# Altium schematic sheet WemosESP8266.SchDoc
size A4
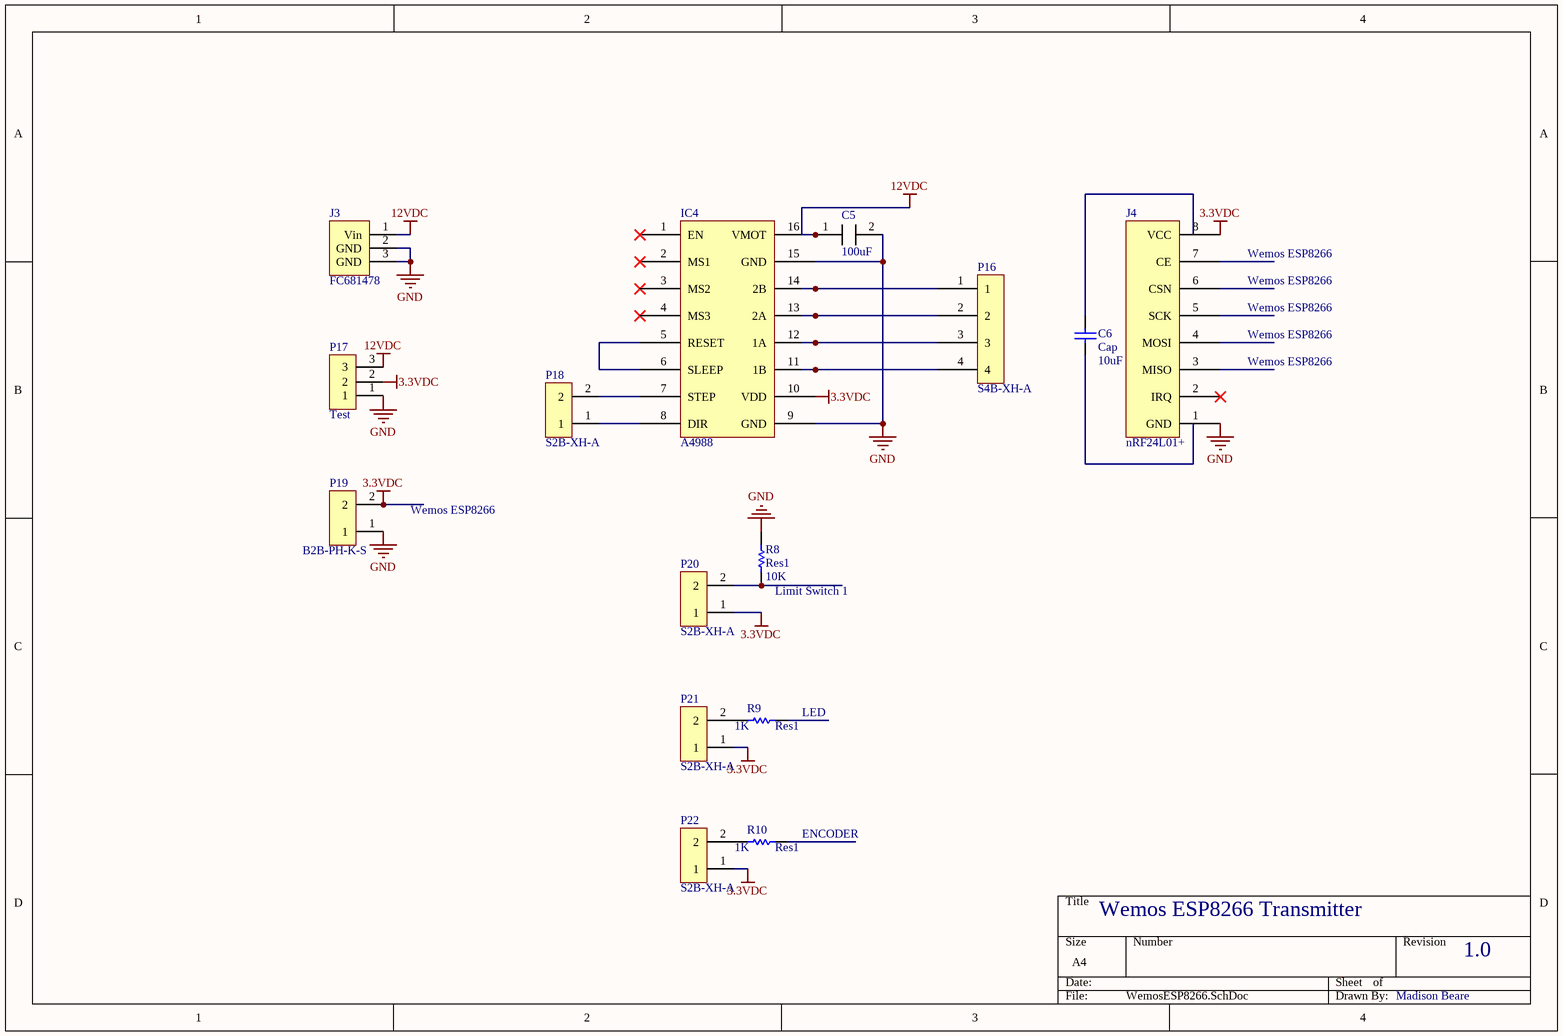
[diagram p0: WemosESP8266.SchDoc]

## Parts
C5  100uF  [EEE-FP1H101AP]
C6  Cap  value 10uF  [RAD-0.3]
IC4  A4988
J3  FC681478
J4  nRF24L01+
P16  S4B-XH-A
P17  Test
P18  S2B-XH-A
P19  B2B-PH-K-S
P20  S2B-XH-A
P21  S2B-XH-A
P22  S2B-XH-A
R8  Res1  value 10K  [AXIAL-0.3]
R9  Res1  value 1K  [AXIAL-0.3]
R10  Res1  value 1K  [AXIAL-0.3]

## Nets
3.3VDC: IC4.10(VDD) J4.8(VCC) P17.2 P19.2 P20.1 P21.1 P22.1
12VDC: C5.1(+-) IC4.16(VMOT) J3.1(Vin) P17.3
GND: C5.2 IC4.9(GND) IC4.15(GND) J3.2(GND) J3.3(GND) J4.1(GND) P19.1 R8.2
NetIC4_5: IC4.5(RESET) IC4.6(SLEEP)
NetIC4_7: IC4.7(STEP) P18.2
NetIC4_8: IC4.8(DIR) P18.1
NetIC4_11: IC4.11(1B) P16.4
NetIC4_12: IC4.12(1A) P16.3
NetIC4_13: IC4.13(2A) P16.2
NetIC4_14: IC4.14(2B) P16.1
NetP20_2: P20.2 R8.1
NetP21_2: P21.2 R9.1
NetP22_2: P22.2 R10.1

Not connected (* = marked no-connect by the designer): C6 1 2; IC4 1(EN)* 2(MS1)* 3(MS2)* 4(MS3)*; J4 2(IRQ)* 3(MISO) 4(MOSI) 5(SCK) 6(CSN) 7(CE); P17 1; R9 2; R10 2

## Notes on the sheet
- Wemos ESP8266
- (near R8) Limit Switch 1
- (near R9) LED
- (near R10) ENCODER
- Wemos ESP8266 Transmitter
- 1.0
- Madison Beare
- Labels drawn without touching a wire or pin: GND

## Library data of the parts
C5 = EEE-FP1H101AP: 100uF capacitor smd 8.3x8.3 dimensions
C6 = Cap: Capacitor; Published: 8-Jun-2000; LatestRevisionDate: 17-Jul-2002; LatestRevisionNote: Re-released for DXP Platform.; PackageReference: RAD-0.3; Publisher: Altium Limited; PackageDescription: Radial Cap, Thru-Hole; 2 Leads; 0.3 in Pin Spacing
J3 = FC681478: CLIFF ELECTRONIC COMPONENTS         FC681478            CONNECTOR, POWER ENTRY, RCPT, 2A, 16VDC; Gender: Male; Voltage Rating: 16V; Supplier 1: Farnell; Manufacturer: Cliff; Manufacturer Part Number: FC681478; RoHS: Yes; Category: Connectors; Stock 1: 534; Pricing 1: 1=1.94000, 50=0.87800, 100=0.78800, 250=0.70300, 500=0.66600, 1000=0.65500 (GBP); Mount: Through Hole; Color: Black; Termination: Through Hole; Current Rating: 2A; Orientation: Right Angle; Voltage Rating (DC): 16V; Length: 15.2mm; Width: 9mm; REACH SVHC: No SVHC; ComponentLink1URL: https://datasheet.ciiva.com/46428/1859070-46428805.pdf?src-supplier=Element14; ComponentLink1Description: https://datasheet.ciiva.com/46428/1859070-46428805.pdf?src-supplier=Element14; Supplier Part Number 1: 2450496
J4 = WRL-00691: SPARKFUN TRANSCEIVER BREAKOUT -; Frequency: 2.4GHz; Supplier 1: Digi-Key; Manufacturer: SparkFun; Manufacturer Part Number: WRL-00691; RoHS: No; Category: RF Semiconductors and Devices; Stock 1: 59; Pricing 1: 1=20.95000 (USD); ComponentLink1URL: https://github.com/sparkfun/Transceiver_Breakout-nRF24L01/tree/V_1.3?src-supplier=Digi-Key; ComponentLink1Description: https://github.com/sparkfun/Transceiver_Breakout-nRF24L01/tree/V_1.3?src-supplier=Digi-Key; Supplier Part Number 1: 1568-1295-ND
P16 = S4B-XH-A(LF)(SN): Conn Shrouded Header HDR 4 POS 2.5mm Solder RA Thru-Hole Box; Manufacturer: JST; Current Rating: 3A; Number of Positions: 4; Voltage Rating: 250V; Contact Resistance: 20mR; Insulation Resistance: 1GR; Gender: Male; Connector Type: Male Pin; Wire/Cable Gauge: 22AWG; Supplier 1: Digi-Key; Manufacturer Part Number: S4B-XH-A(LF)(SN); RoHS: Yes; Category: Headers and Wire Housings; Stock 1: 8950; Pricing 1: 1=0.27000, 10=0.25700, 100=0.17850, 500=0.15100, 1000=0.12355, 5000=0.10982, 10000=0.09953 (USD); Mount: Through Hole; Contact Material: Brass; Contact Plating: Tin,Lead,Copper; Color: Natural; Housing Color: White; Housing Material: Polyamide; Min Operating Temperature: -25°C; Max Operating Temperature: 85°C; Termination: Press-Fit; Orientation: Right Angle; Package Quantity: 500; Number of Rows: 1; Packaging: Bulk; Voltage Rating (AC): 250V; Max Current Rating: 3A; Number of Contacts: 4; Max Voltage Rating (AC): 250V; Length: 12.4mm; Pitch: 2.5mm; Lead Pitch: 2.5mm; Depth: 11.5mm; Lead Free: Lead Free; REACH SVHC: No SVHC; ComponentLink1URL: https://datasheet.ciiva.com/726/exh-726400.pdf?src-supplier=Digi-Key; ComponentLink1Description: https://datasheet.ciiva.com/726/exh-726400.pdf?src-supplier=Digi-Key; ComponentLink2URL: https://datasheet.ciiva.com/26924/getdatasheetpartid-449045-26924078.pdf?src-supplier=Verical; ComponentLink2Description: https://datasheet.ciiva.com/26924/getdatasheetpartid-449045-26924078.pdf?src-supplier=Verical; ComponentLink3URL: https://datasheet.ciiva.com/8052/5448-8052236.pdf?src-supplier=Element14; ComponentLink3Description: https://datasheet.ciiva.com/8052/5448-8052236.pdf?src-supplier=Element14; Supplier Part Number 1: 455-2243-ND
P17 = Test_Header
P18 P20-P22 = S2B-XH-A(LF)(SN): Conn Shrouded Header HDR 2 POS 2.5mm Solder RA Thru-Hole Box; Manufacturer: JST; Current Rating: 3A; Contact Resistance: 20mR; Voltage Rating (AC): 250V; Number of Positions: 2; Insulation Resistance: 1GR; Gender: Male; Connector Type: Male Pin; Wire/Cable Gauge: 22AWG; Supplier 1: Digi-Key; Manufacturer Part Number: S2B-XH-A(LF)(SN); RoHS: Yes; Category: Headers and Wire Housings; Stock 1: 54562; Pricing 1: 1=0.18000, 10=0.16800, 100=0.11710, 500=0.09904, 1000=0.08104, 5000=0.07204, 10000=0.06528 (USD); Mount: Through Hole; Contact Material: Brass; Contact Plating: Tin,Copper,Lead; Color: Natural; Housing Color: White; Housing Material: Polyamide; Min Operating Temperature: -25°C; Max Operating Temperature: 85°C; Number of Rows: 1; Voltage Rating: 250V; Termination: Press-Fit; Number of Contacts: 2; Orientation: Right Angle; Max Current Rating: 3A; Package Quantity: 1000; Packaging: Bulk; Max Voltage Rating (AC): 250V; Max Voltage Rating (DC): 250V; Length: 7.4mm; Pitch: 2.5mm; Lead Pitch: 2.5mm; Depth: 11.5mm; Lead Free: Lead Free; REACH SVHC: No SVHC; ComponentLink1URL: https://datasheet.ciiva.com/16208/s2b-xh-alfsn-16208978.pdf?src-supplier=Future+Electronics; ComponentLink1Description: https://datasheet.ciiva.com/16208/s2b-xh-alfsn-16208978.pdf?src-supplier=Future+Electronics; ComponentLink2URL: https://datasheet.ciiva.com/8052/1684882-8052211.pdf?src-supplier=Element14; ComponentLink2Description: https://datasheet.ciiva.com/8052/1684882-8052211.pdf?src-supplier=Element14; ComponentLink3URL: https://datasheet.ciiva.com/11746/0900766b8082f560-11746947.pdf?src-supplier=RSComponents; ComponentLink3Description: https://datasheet.ciiva.com/11746/0900766b8082f560-11746947.pdf?src-supplier=RSComponents; ComponentLink4URL: https://datasheet.ciiva.com/26924/getdatasheetpartid-645395-26924076.pdf?src-supplier=Verical; ComponentLink4Description: https://datasheet.ciiva.com/26924/getdatasheetpartid-645395-26924076.pdf?src-supplier=Verical; ComponentLink5URL: https://datasheet.ciiva.com/26894/getdatasheetpartid-640270-26894603.pdf?src-supplier=Verical; ComponentLink5Description: https://datasheet.ciiva.com/26894/getdatasheetpartid-640270-26894603.pdf?src-supplier=Verical; ComponentLink6URL: https://datasheet.ciiva.com/26894/getdatasheetpartid-441330-26894909.pdf?src-supplier=Verical; ComponentLink6Description: https://datasheet.ciiva.com/26894/getdatasheetpartid-441330-26894909.pdf?src-supplier=Verical; ComponentLink7URL: https://datasheet.ciiva.com/20207/523653-20207183.pdf?src-supplier=Rapid+Electronics; ComponentLink7Description: https://datasheet.ciiva.com/20207/523653-20207183.pdf?src-supplier=Rapid+Electronics; ComponentLink8URL: https://datasheet.ciiva.com/726/exh-726412.pdf?src-supplier=Digi-Key; ComponentLink8Description: https://datasheet.ciiva.com/726/exh-726412.pdf?src-supplier=Digi-Key; Supplier Part Number 1: 455-2257-ND
P19 = B2B-PH-K-S(LF)(SN): Connector Header, PH Series, 2 Position, 2.00mm, Through Hole, Press-Fit, Solder, Natural; Manufacturer: JST; Supplier 1: Digi-Key; Manufacturer Part Number: B2B-PH-K-S(LF)(SN); RoHS: Yes; Category: Connectors; Stock 1: 37001; Pricing 1: 1=0.17000, 10=0.16200, 100=0.10020, 500=0.08288, 1000=0.07252, 5000=0.06216, 10000=0.06044 (USD); Weight: 0.0625lb; Length: 0.2inch; Height: 0.35inch; Width: 0.24inch; ComponentLink1URL: http://www.farnell.com/datasheets/2057211.pdf?src-supplier=Farnell; ComponentLink1Description: http://www.farnell.com/datasheets/2057211.pdf?src-supplier=Farnell; ComponentLink2URL: http://www.farnell.com/datasheets/2057211.pdf?src-supplier=Newark; ComponentLink2Description: http://www.farnell.com/datasheets/2057211.pdf?src-supplier=Newark; ComponentLink3URL: http://www.farnell.com/datasheets/2057211.pdf?src-supplier=Element14; ComponentLink3Description: http://www.farnell.com/datasheets/2057211.pdf?src-supplier=Element14; Supplier Part Number 1: 455-1704-ND
R8-R10 = Res1: Resistor; Published: 8-Jun-2000; LatestRevisionDate: 17-Jul-2002; LatestRevisionNote: Re-released for DXP Platform.; PackageReference: AXIAL-0.3; Publisher: Altium Limited; PackageDescription: Axial Device, Thru-Hole; 2 Leads; 0.3 in Pin Spacing
IC4 = a4988: ComponentLink1Description: New link; ComponentLink1URL: *